# EAGLE design Toybox (EAGLE 7.7.0)
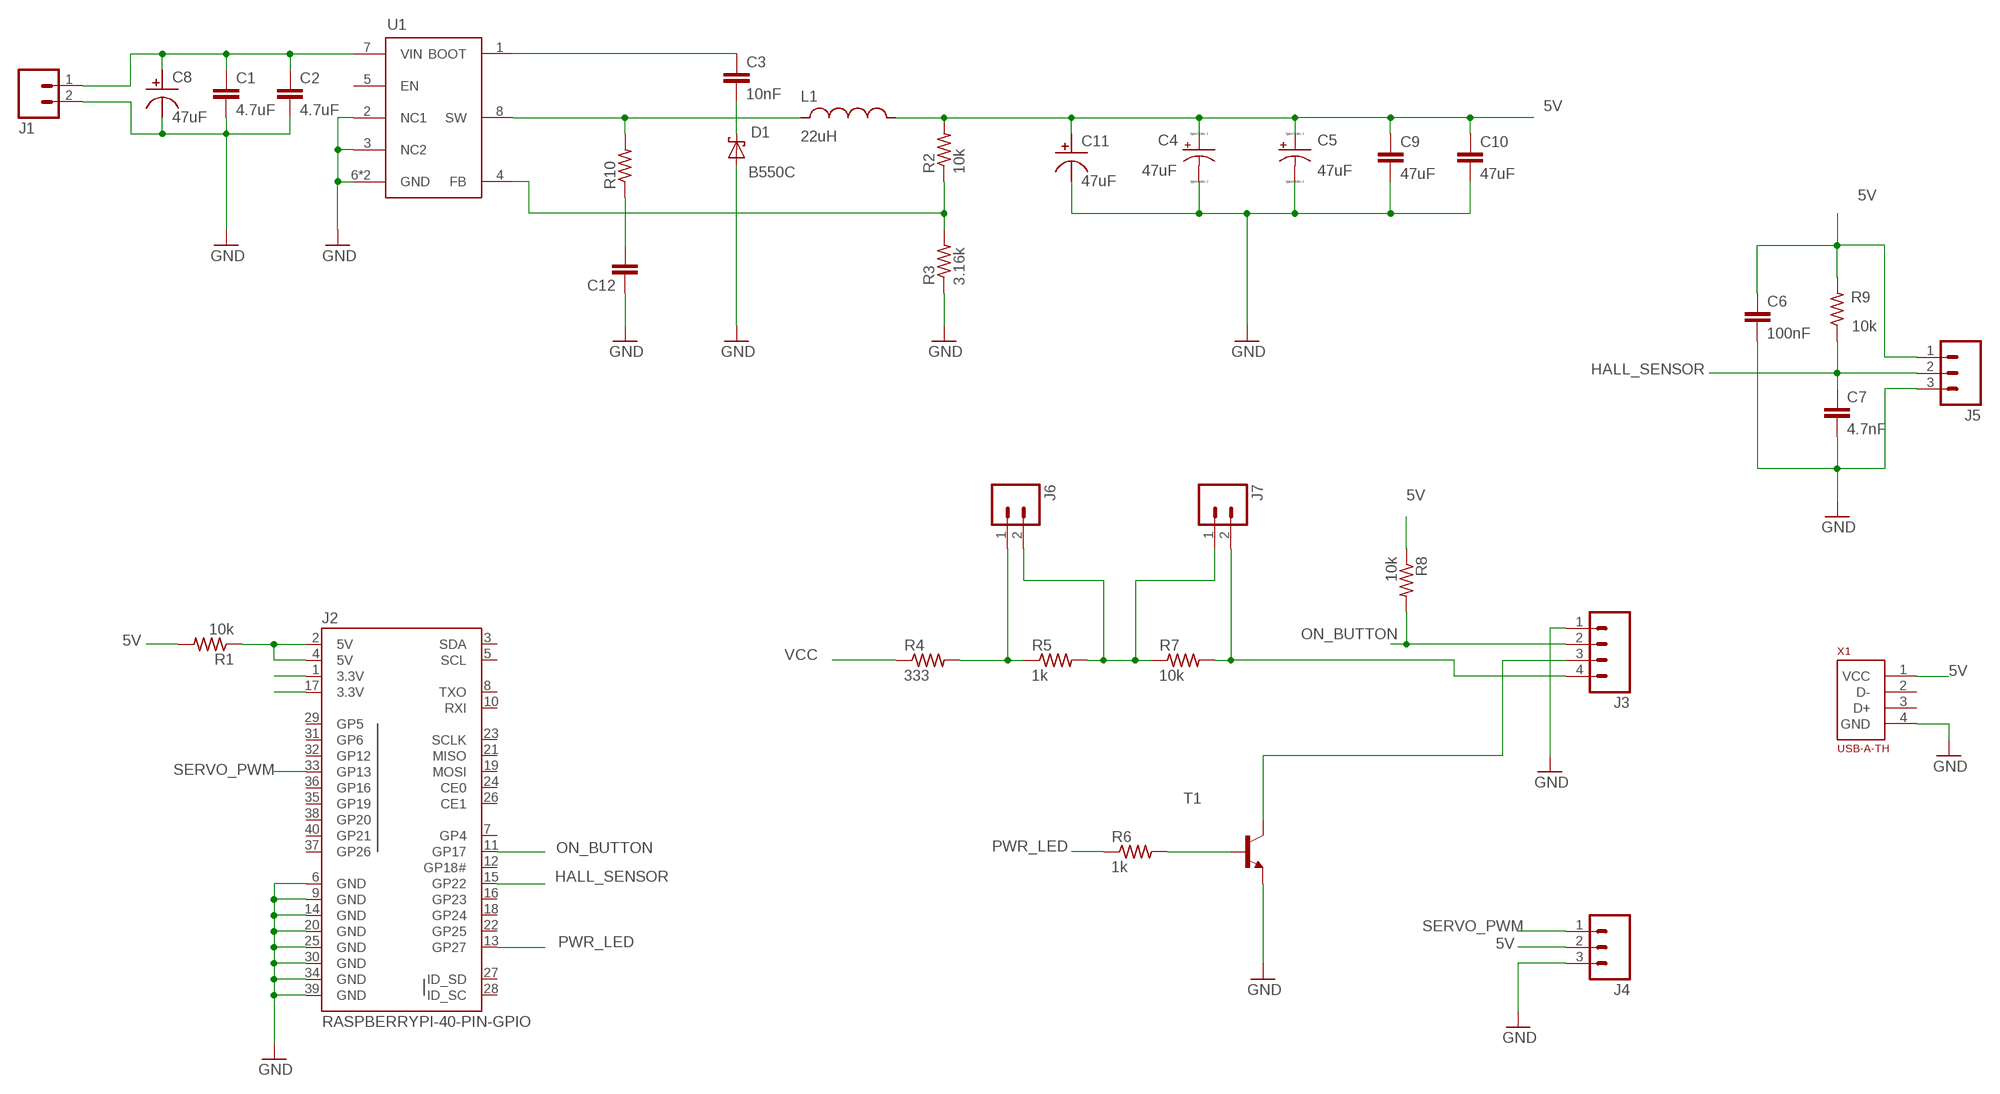
[diagram p0: schematic, sheet 1]

## Parts
C1  4.7uF  C-EUC0805  [C0805]
C2  4.7uF  C-EUC0805  [C0805]
C3  10nF  C-EUC0805  [C0805]
C4  47uF  CPOL-USB/3528-21R  [T/3528-12R]
C5  47uF  CPOL-USB/3528-21R  [T/3528-12R]
C6  100nF  C-EUC0805  [C0805]
C7  4.7nF  C-EUC0805  [C0805]
C8  47uF  CPOL-UUR-6.3  [CPOL-RADIAL-6.3]
C9  47uF  CAP1210  [1210]
C10  47uF  CAP1210  [1210]
C11  47uF  CPOL-SVPF-6.3  [CPOL-RADIAL-6.3]
C12  C-EUC0805  [C0805]
D1  B550C  SCHOTTKY-DIODESMC  [SMC]
J1  M025MM  [SCREWTERMINAL-5MM-2]
J2  RASPBERRYPI-40-PIN-GPIO  [2X20-SHROUDED]
J3  M041X04_NO_SILK  [1X04_NO_SILK]
J4  M03PTH  [1X03]
J5  M03PTH  [1X03]
J6  M02PTH  [1X02]
J7  M02PTH  [1X02]
L1  22uH  SRR1210  [IND-SRR1210]
R1  10k  R-US_R0805  [R0805]
R2  10k  R-US_R0805  [R0805]
R3  3.16k  R-US_R0805  [R0805]
R4  333  R-US_R0805  [R0805]
R5  1k  R-US_R0805  [R0805]
R6  1k  R-US_R0805  [R0805]
R7  10k  R-US_R0805  [R0805]
R8  10k  R-US_R0805  [R0805]
R9  10k  R-US_R0805  [R0805]
R10  R-US_R0805  [R0805]
T1  MMBT2222ALT1-NPN-SOT23-BEC  [SOT23-BEC]
U1  RT8289  [RT8289-SOP-8]
X1  USB-A-TH  [USB-A-TH]

## Nets
5V: C4.+ C5.+ C6.1 C9.1 C10.1 C11.1 J4.2 J5.1 L1.P$2 R1.2 R2.2 R8.1 R9.2 X1.1(VCC)
GND: C1.2 C2.2 C4.- C5.- C6.2 C7.2 C8.2 C9.2 C10.2 C11.2 C12.1 D1.A J1.2 J2.6(GND) J2.9(GND) J2.14(GND) J2.20(GND) J2.25(GND) J2.30(GND) J2.34(GND) J2.39(GND) J3.1 J4.3 J5.3 R3.1 T1.E U1.2(NC1) U1.3(NC2) U1.6(GND) U1.9(GND) X1.4(GND)
HALL_SENSOR: C7.1 J2.15(GP22) J5.2 R9.1
N$1: J3.3 T1.C
N$2: J2.2(5V) J2.4(5V) R1.1
N$3: R2.1 R3.2 U1.4(FB)
N$4: R6.2 T1.B
N$5: C3.2 D1.C
N$6: C3.1 U1.1(BOOT)
N$7: J6.1 R4.2 R5.1
N$8: J6.2 J7.1 R5.2 R7.1
N$9: J3.4 J7.2 R7.2
N$10: C12.2 R10.1
NC1: J2.1(3.3V)
NC2: J2.17(3.3V)
ON_BUTTON: J2.11(GP17) J3.2 R8.2
PWR_LED: J2.13(GP27) R6.1
SERVO_PWM: J2.33(GP13) J4.1
SW: L1.P$1 R10.2 U1.8(SW)
VCC: C1.1 C2.1 C8.1 J1.1 R4.1 U1.7(VIN)
Unconnected: J2.3(SDA) J2.5(SCL) J2.7(GP4) J2.8(TXO) J2.10(RXI) J2.12(GP18#) J2.16(GP23) J2.18(GP24) J2.19(MOSI) J2.21(MISO) J2.22(GP25) J2.23(SCLK) J2.24(CE0) J2.26(CE1) J2.27(ID_SD) J2.28(ID_SC) J2.29(GP5) J2.31(GP6) J2.32(GP12) J2.35(GP19) J2.36(GP16) J2.37(GP26) J2.38(GP20) J2.40(GP21) U1.5(EN) X1.2(D-) X1.3(D+)

## Library data of the parts
C1-C3 C6 C7 C12 = resistor:C-EU: CAPACITOR, European symbol
C4 C5 = resistor:CPOL-US: POLARIZED CAPACITOR, American symbol
C8 = Master:CPOL-UUR-6.3: Nichicon UUR Series Aluminum Capacitor 6.3mm Radial Can Surface mount http://nichicon-us.com/english/products/pdfs/e-uur.pdf
C9 C10 = SparkFun-Passives:CAP: Capacitor Standard 0603 ceramic capacitor, and 0.1" leaded capacitor.
C11 = Master:CPOL-SVPF-6.3: Panasonic SVPF Aluminum Polymer Capacitor https://industrial.panasonic.com/ww/products/capacitors/polymer-capacitors/os-con/svpf/25SVPF47M
D1 = diode:SCHOTTKY-DIODE: Schottky Diode
J1 = SparkFun-Connectors:M02: Standard 2-pin 0.1" header. Use with - straight break away headers ( PRT-00116) - right angle break away headers (PRT-00553) - swiss pins (PRT-00743) - machine pins (PRT-00117) - female headers (PRT-00115) Molex polarized connector foot print use with: PRT-08233 with associated crimp pins and housings. 2.54_SCREWTERM for use with PRT-10571. 3.5mm Screw Terminal footprints for PRT-08084 5mm Screw Terminal footprints for use with PRT-08432; STOREFRONT_ID: PRT-08432
J2 = SparkFun-Boards:RASPBERRYPI-40-PIN-GPIO: Second Generation Raspberry Pi GPIO Header 2x20 pin connector, as found on B, B+, A+ models.
J3 = SparkFun-Connectors:M04: Header 4 Standard 4-pin 0.1" header. Use with straight break away headers (SKU : PRT-00116), right angle break away headers (PRT-00553), swiss pins (PRT-00743), machine pins (PRT-00117), and female headers (PRT-00115). Molex polarized connector foot print use with SKU : PRT-08231 with associated crimp pins and housings. 1MM SMD Version SKU: PRT-10208; PROD_ID: CONN-09696
J4 J5 = SparkFun-Connectors:M03: Header 3 Standard 3-pin 0.1" header. Use with straight break away headers (SKU : PRT-00116), right angle break away headers (PRT-00553), swiss pins (PRT-00743), machine pins (PRT-00117), and female headers (PRT-00115). Molex polarized connector foot print use with SKU : PRT-08232 with associated crimp pins and housings.
J6 J7 = SparkFun-Connectors:M02: Standard 2-pin 0.1" header. Use with - straight break away headers ( PRT-00116) - right angle break away headers (PRT-00553) - swiss pins (PRT-00743) - machine pins (PRT-00117) - female headers (PRT-00115) Molex polarized connector foot print use with: PRT-08233 with associated crimp pins and housings. 2.54_SCREWTERM for use with PRT-10571. 3.5mm Screw Terminal footprints for PRT-08084 5mm Screw Terminal footprints for use with PRT-08432
L1 = Master:SRR1210: SRR1210 Inductor 22uH http://www.bourns.com/docs/Product-Datasheets/SRR1210.pdf
R1-R10 = resistor:R-US_: RESISTOR, American symbol
T1 = transistor:*-NPN-: NPN Transistror BF959 corrected 2008.03.06
U1 = Toybox:RT8289: RT8289GSP - Step-Down Regulator "Buck Converter" Technical Specifications: 5A Max Output 5.5V - 32V Input 1.2V - 26V Output
X1 = Toybox:USB-A-TH: USB Type A Female Connector 4 pin through hole FCI 87520-1010BLF http://datasheet.octopart.com/87520-1010BLF-FCI-datasheet-41567514.pdf

## Board
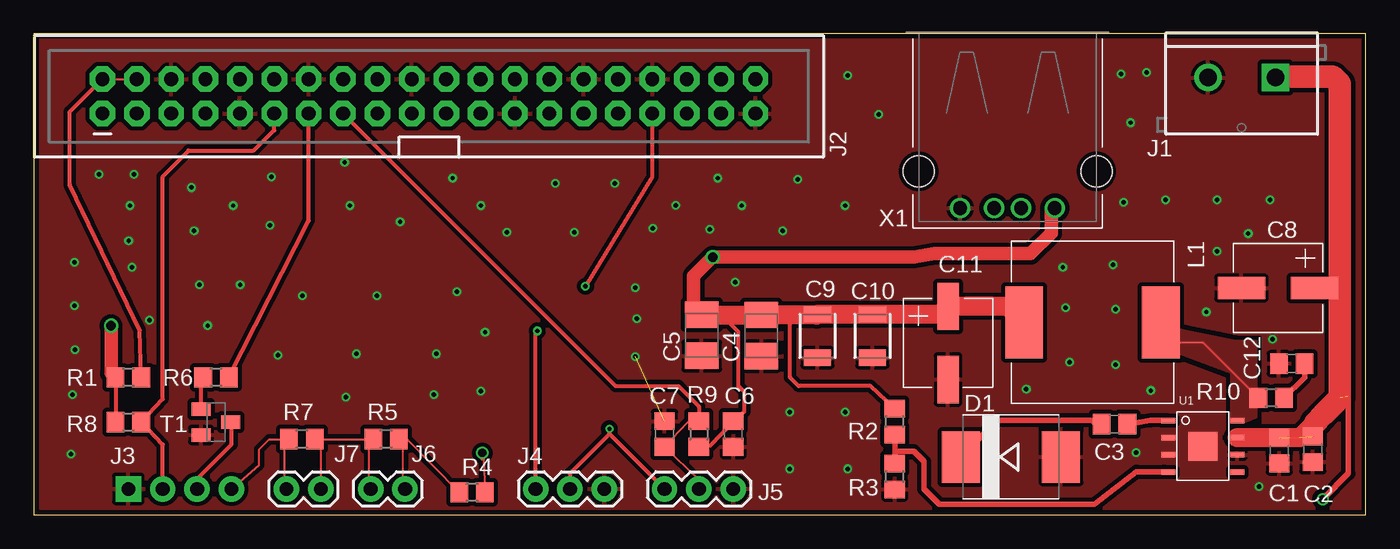
[diagram p1: board, top side]
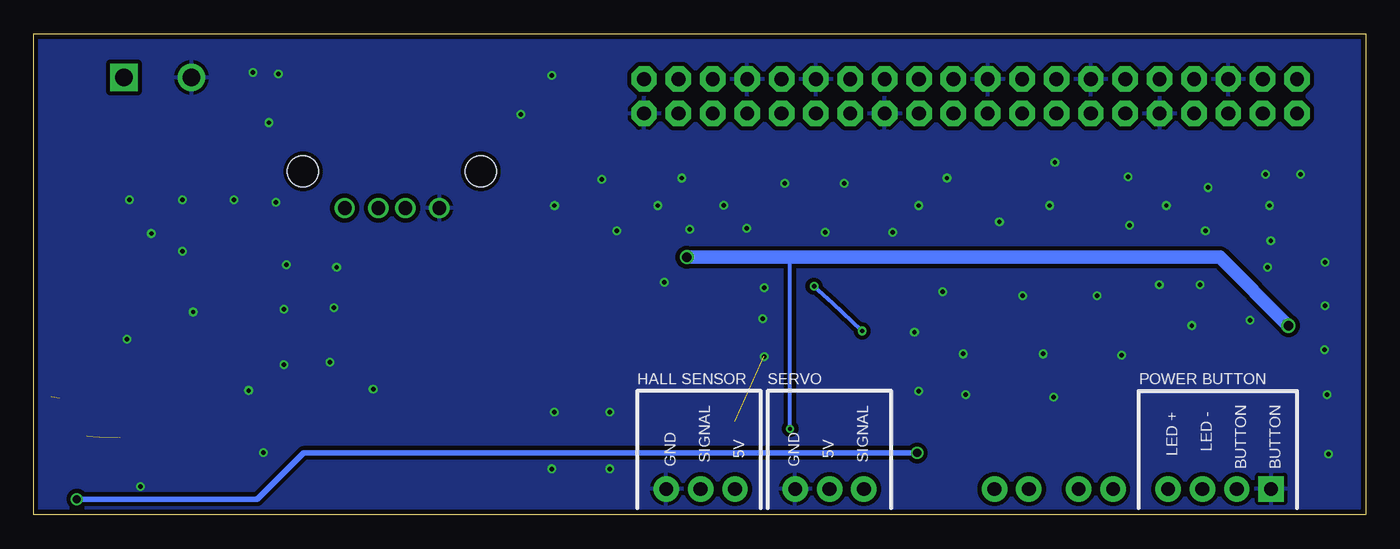
[diagram p2: board, bottom side, seen from below]

Size 98.42 x 35.56 mm. Coordinates in mm from the lower left corner, seen from the top.
Outline: 0,0 98.42,0 98.42,35.56 0,35.56 0,0
Copper layers (1*16): Top 0.035mm / dielectric 1.5mm / Bottom 0.035mm
Design rules "SeeedStudio_2layer_DRU_no_angle_20140221": minimum track width 6mil, minimum drill 12mil, track to track 6mil, track to pad 6mil, pad to pad 6mil, via to via 6mil, smd to smd 0mil, copper to edge 10mil, drill to drill 10mil, minimum pad ring 10mil, minimum via ring 6mil, stop-mask expansion 2mil, vias tented up to drill 100mil, thermal gap 10mil

### Footprints (pad centres in the part's own frame; a part is rotated, then mirrored left to right if it is on the bottom)
C0805 = smd 1.3 x 1.5: 1 -0.95,0; 2 0.95,0
T/3528-12R = smd 1.95 x 2.5: + 1.525,0; - -1.525,0
CPOL-RADIAL-6.3 = smd 1.6 x 3.5: 1 0,2.7; 2 0,-2.7
1210 = smd 1.2 x 2: 1 -1.6,0; 2 1.6,0
SMC = smd 2.8 x 3.8: A 3.7,0; C -3.7,0
SCREWTERMINAL-5MM-2 = drill 1.3 pad 2.032 square: 1 0,0 | drill 1.3 pad 2.032: 2 5,0
2X20-SHROUDED = drill 1.016 pad 1.88 octagon: 1 -1.27,24.13; 2 1.27,24.13; 3 -1.27,21.59; 4 1.27,21.59; 5 -1.27,19.05; 6 1.27,19.05; 7 -1.27,16.51; 8 1.27,16.51; 9 -1.27,13.97; 10 1.27,13.97; 11 -1.27,11.43; 12 1.27,11.43; 13 -1.27,8.89; 14 1.27,8.89; 15 -1.27,6.35; 16 1.27,6.35; 17 -1.27,3.81; 18 1.27,3.81; 19 -1.27,1.27; 20 1.27,1.27; 21 -1.27,-1.27; 22 1.27,-1.27; 23 -1.27,-3.81; 24 1.27,-3.81; 25 -1.27,-6.35; 26 1.27,-6.35; 27 -1.27,-8.89; 28 1.27,-8.89; 29 -1.27,-11.43; 30 1.27,-11.43; 31 -1.27,-13.97; 32 1.27,-13.97; 33 -1.27,-16.51; 34 1.27,-16.51; 35 -1.27,-19.05; 36 1.27,-19.05; 37 -1.27,-21.59; 38 1.27,-21.59; 39 -1.27,-24.13; 40 1.27,-24.13
1X04_NO_SILK = drill 1.016 pad 1.88 square: 1 0,0 | drill 1.016 pad 1.88: 2 2.54,0; 3 5.08,0; 4 7.62,0
1X03 = drill 1.016 pad 1.88: 1 0,0; 2 2.54,0; 3 5.08,0
1X02 = drill 1.016 pad 1.88: 1 0,0; 2 2.54,0
IND-SRR1210 = smd 5.3 x 2.8: P$1 0,5.05; P$2 0,-5.05
R0805 = smd 1.3 x 1.5: 1 -0.95,0; 2 0.95,0
SOT23-BEC = smd 1 x 1.4: B -0.95,-1.1; C 0,1.1; E 0.95,-1.1
RT8289-SOP-8 = smd 0.406 x 1.016: 1 -1.905,-2.54; 2 -0.635,-2.54; 3 0.635,-2.54; 4 1.905,-2.54; 5 1.905,2.54; 6 0.635,2.54; 7 -0.635,2.54; 8 -1.905,2.54 | smd 2.134 x 2.134: 9 0,0
USB-A-TH = drill 1: 1 -3.5,6.01; 2 -1,6.01; 3 1,6.01; 4 3.5,6.01 | hole 2.3: -6.57,3.3; 6.57,3.3

### Placement (x,y rotation side)
C1  92.04,4.75 270 top
C2  94.52,4.84 270 top
C3  79.86,6.7 180 top
C4  53.76,13.24 90 top
C5  49.36,13.28 90 top
C6  51.69,5.97 270 top
C7  46.61,5.97 90 top
C8  91.95,16.76 270 top
C9  57.91,13.21 270 top
C10  61.98,13.21 270 top
C11  67.56,12.7 0 top
C12  92.96,11.18 0 top
D1  72.2,4.27 0 top
J1  91.76,32.33 180 top
J2  29.2,30.94 90 top
J3  6.99,1.91 0 top
J4  37.08,1.91 0 top
J5  46.61,1.91 0 top
J6  27.43,1.91 180 top
J7  21.21,1.91 180 top
L1  78.23,14.22 270 top
R1  6.99,10.16 180 top
R2  63.62,6.89 90 top
R3  63.62,2.82 90 top
R4  32.38,1.65 180 top
R5  26.04,5.59 180 top
R6  13.46,10.16 180 top
R7  19.81,5.59 180 top
R8  6.99,6.86 0 top
R9  49.15,5.97 270 top
R10  91.44,8.64 180 top
T1  13.46,6.84 270 top
U1  86.39,5.07 270 top
X1  71.95,28.69 180 top

### Tracks (layer width: path | path; a pad name or v marks a point on that pad's centre or on a via)
5V  (via drill 0.3, 0.7)
  Top 0.305: R9.2 49.99,5.12 C6.1 52.51,7.64 52.51,9.09 52.07,9.53 52.07,13.5 50.8,14.77 | R1.2 R8.1 | R2.2 61.84,9.53 56.52,9.53 55.88,10.16 55.88,14.77 | J5.1 42.55,5.97 | 42.55,5.97 v42.55,6.35 | 42.55,5.97 39.62,3.05 J4.2
  Top 1: 50.8,14.77 48.81,14.77 48.77,14.73 48.77,17.65 v50.16,19.05 65.02,19.05 66.55,19.3 73.66,19.3 75.18,20.83 75.18,22.41 X1.1 | v5.71,13.97 5.71,10.48 R1.2
  Top 1.4: L1.P$2 72.01,15.4 C11.1 66.97,14.81 C10.1 C9.1 57.87,14.77 55.88,14.77 C4.+ 50.8,14.77 49.39,14.77 C5.+
  Bottom 0.305: v42.55,6.35 42.55,19.05
  Bottom 1: v50.16,19.05 42.55,19.05 10.79,19.05 v5.71,13.97
GND  (via drill 0.33)  (1 unrouted)
  other vias: 33.02,22.86 33.02,9.14 23.37,22.86 3.05,12.19 7.11,22.86 14.73,22.86 52.32,22.86 59.94,22.86 7.01,20.26 4.81,25.16 7.41,25.16 3.01,15.46 3.01,18.66 2.85,8.89 2.75,4.49 8.55,14.39 7.25,18.29 11.85,20.99 11.65,24.19 17.55,24.99 17.45,21.39 12.25,16.99 15.25,16.99 12.85,13.99 18.05,11.79 19.85,16.19 25.35,16.19 31.25,16.49 23.85,11.89 29.75,11.89 29.55,8.89 23.05,8.69 33.35,13.49 34.95,20.89 39.95,20.89 42.95,24.49 38.55,24.49 30.95,24.89 44.45,16.79 44.55,14.49 44.45,11.69 55.85,7.59 59.95,7.59 60.15,3.39 55.85,3.39 51.85,17.19 47.45,22.89 45.75,21.19 49.95,21.09 55.35,20.99 56.45,24.79 50.55,24.89 60.15,32.49 62.45,29.59 76.05,18.29 79.75,18.49 76.25,15.29 79.95,15.19 79.95,11.09 76.55,11.29 73.35,9.29 82.55,9.19 81.45,4.59 90.55,2.09 86.65,14.99 87.45,19.49 80.35,32.59 82.25,32.69 81.05,28.99 80.55,23.09 83.65,23.29 87.45,23.29 91.35,23.29 89.75,20.79 91.55,12.99 27.07,21.66 22.97,26.06
  pour Top (isolate 0.305, rank 2): 0.51,35.05 0.51,0.51 98.04,0.51 98.04,35.05
  pour Bottom (isolate 0.305): 0.51,35.05 0.51,0.51 98.04,0.51 98.04,35.05
  pour Top (no thermals): 85,6.5 85,3.7 87.8,3.7 87.8,6.5
  pour Top (no thermals): 83.1,6.4 84.8,6.4 84.8,3.9 83,3.9 83,6.4
HALL_SENSOR
  Top 0.152: R9.1 48.31,6.82 C7.1 49.15,2.58 J5.2
  Top 0.305: J2.15 43,9.53 47.62,9.53 49.15,8 R9.1
N$1
  Top 0.305: J3.3 12.06,2.67 14.61,5.21 14.61,6.8 T1.C
N$2
  Top 0.152: J2.2 J2.4
  Top 0.305: R1.1 7.83,13.63 2.67,24.38 2.67,29.81 J2.2
N$3
  Top 0.406: R2.1 R3.2 63.62,4.7 65.02,4.7 65.79,3.94 65.79,1.91 66.93,0.76 78.36,0.76 81.49,3.19 83.54,3.19 U1.4
N$4
  Top 0.305: T1.B 12.36,9.91 R6.2
N$5
  Top 0.406: C3.2 79.01,6.21 78.23,6.99 71.22,6.99 D1.C
N$6
  Top 0.406: U1.1 82.51,6.97 C3.1
N$7
  Top 0.152: R4.2 27.6,5.59 R5.1 27.3,5.17 27.3,1.91 J6.1
N$8
  Top 0.152: R7.1 21.08,5.17 | 21.08,5.17 21.08,5.59 R5.2 24.77,5.17 24.77,1.91 J6.2 | 21.08,5.17 21.21,5.17 J7.1
N$9
  Top 0.152: J3.4 16.64,3.68 16.64,4.83 17.4,5.59 R7.2 18.54,5.17 18.54,1.91 J7.2
N$10
  Top 0.406: R10.1 93.91,10.16 C12.2
ON_BUTTON
  Top 0.305: J3.2 9.53,5.17 R8.2 9.53,8.55 9.53,25.02 11.43,26.92 16.26,26.92 17.77,28.44 J2.11
PWR_LED
  Top 0.305: R6.1 20.31,21.75 J2.13
SERVO_PWM  (via drill 0.33)
  Top 0.305: J4.1 37.08,13.46 v37.21,13.59 | v40.77,16.89 45.71,25.01 J2.33
  Bottom 0.305: v37.21,13.59 39.37,15.62 v40.77,16.89
SW
  Top 0.152: R10.2 86.43,12.7 83.3,12.7 83.28,12.72 L1.P$1
  pour Top (isolate 0.305, no thermals): 88.52,6.86 89.41,6.86 90.3,7.24 90.3,12.83 88.77,12.83 83.69,13.84 83.69,12.32 88.52,10.54
VCC  (via drill 0.6)  (3 unrouted)
  Top 0.152: 33.17,4.19 33.23,4.13 R4.1 | C8.1 96.52,16.76 96.52,16.26
  Top 0.406: 33.17,4.19 v33.15,4.57 | v95.25,1.14 97.16,3.05 97.16,8.76
  Top 1.4: U1.7 93.59,5.7 95.25,7.37
  Top 1.676: J1.1 92.46,32.38 96.01,32.38 96.52,31.88 96.52,16.26 96.52,8.64 95.25,7.37 94.69,6.81
  Bottom 0.406: v33.15,4.57 78.49,4.57 81.92,1.14 v95.25,1.14

### Text on the board
bPlace: POWER BUTTON | SERVO | HALL SENSOR | BUTTON | BUTTON | LED - | LED + | SIGNAL | SIGNAL | 5V | GND | 5V | GND
tDocu: - | +